# EAGLE design WalkSensor_V3.0 (EAGLE 9.6.0)
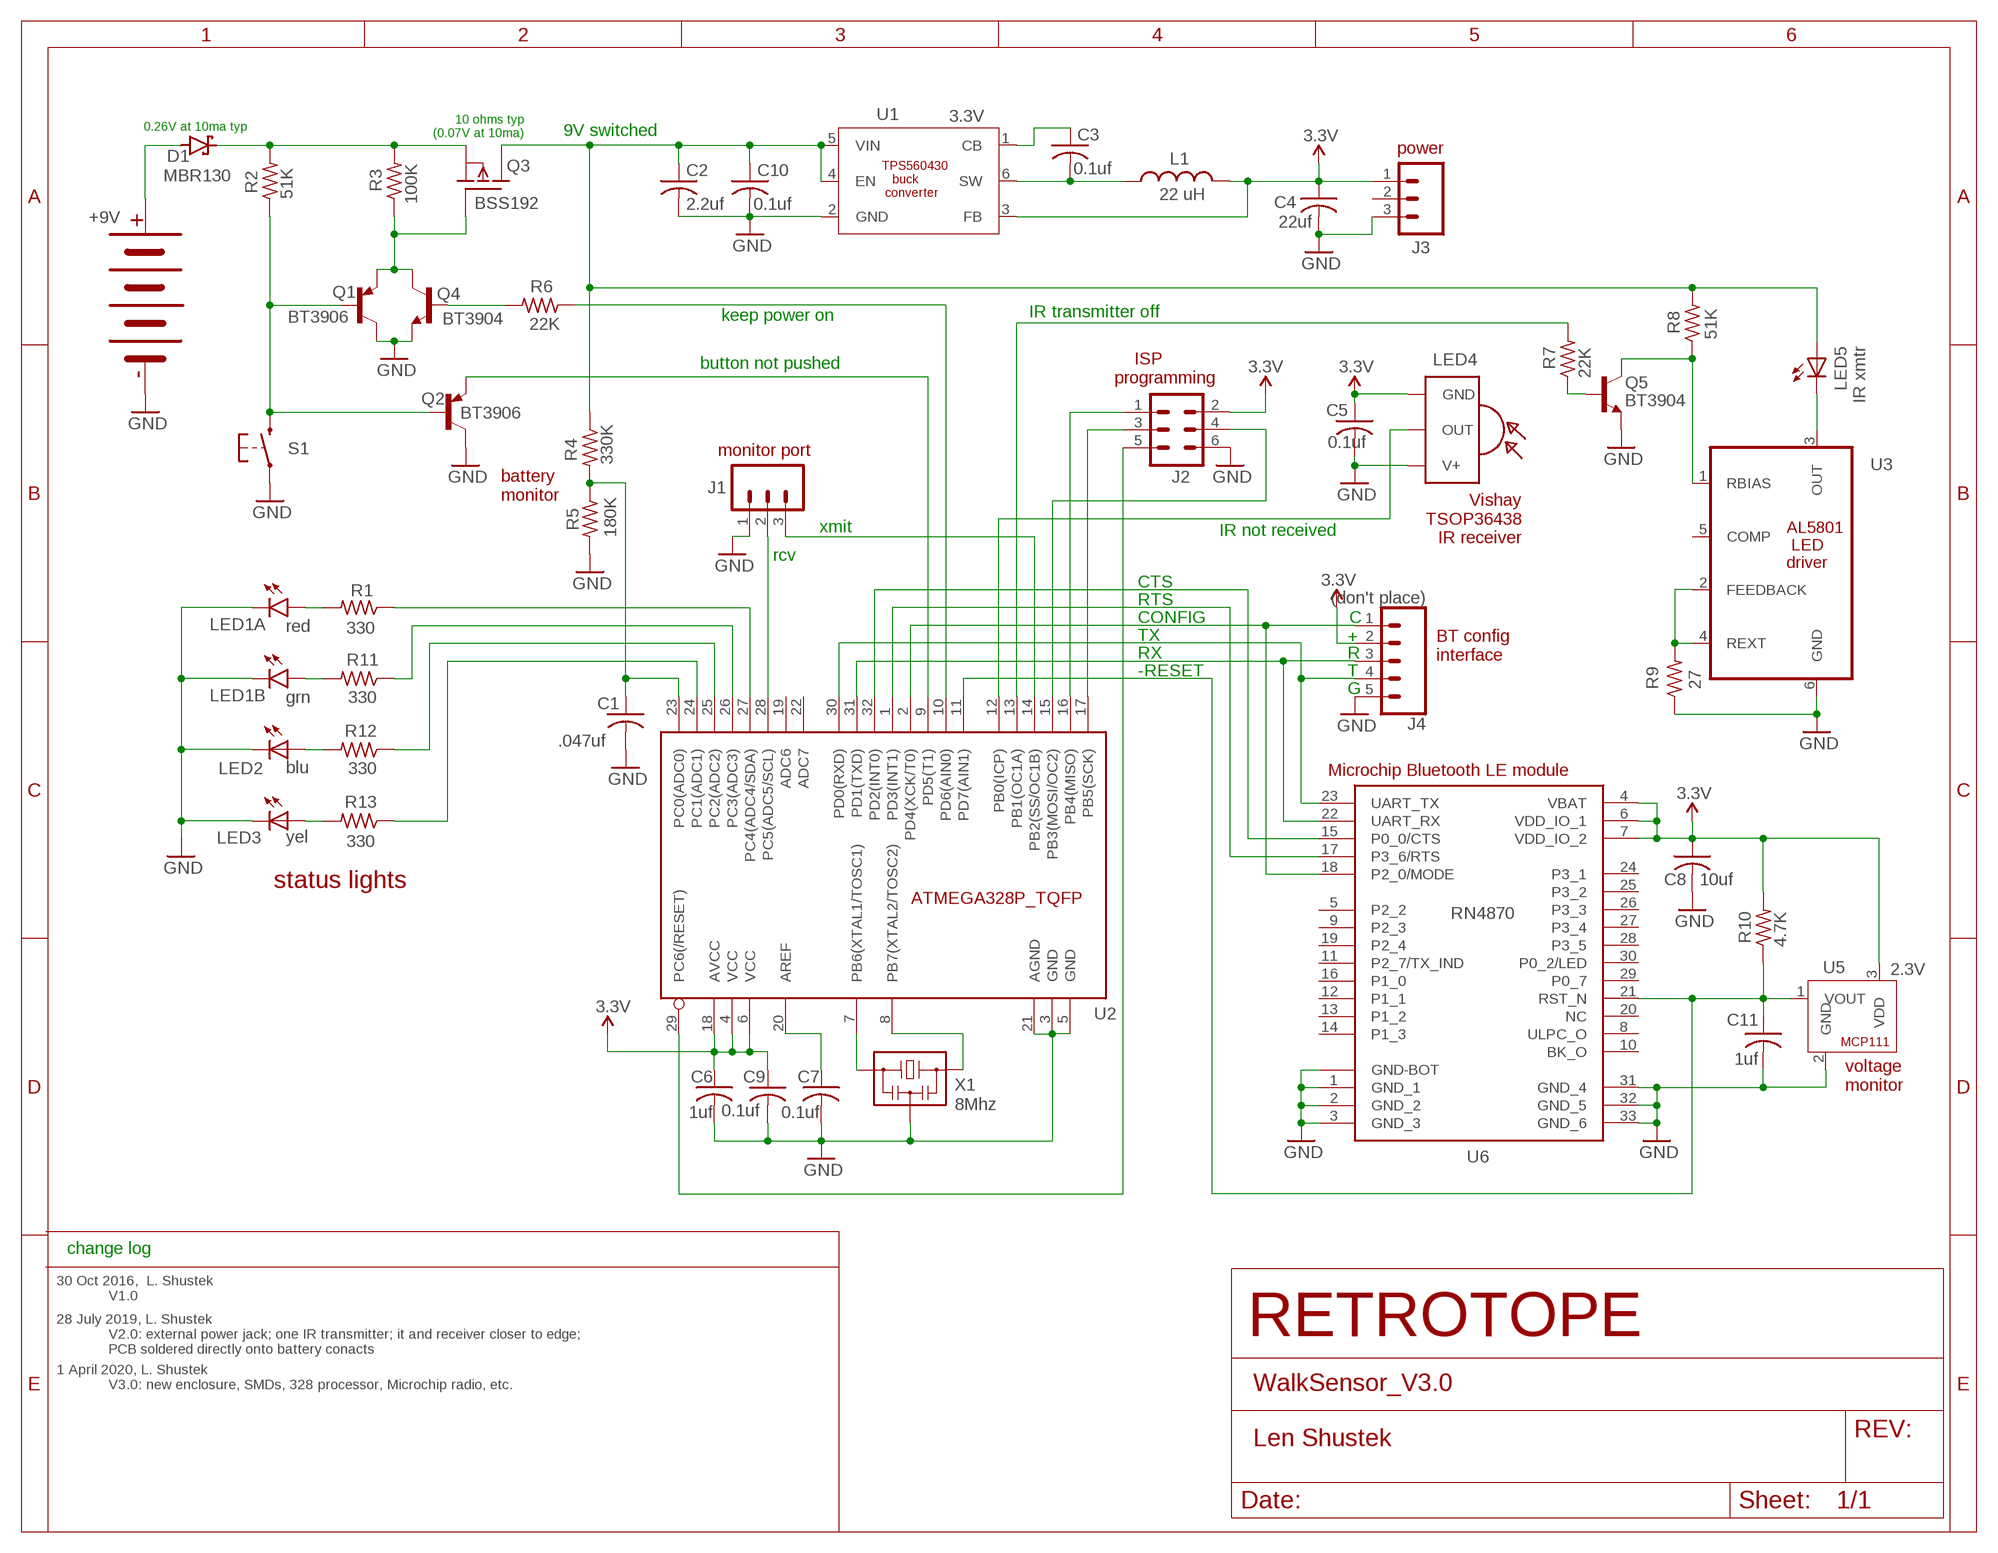
[diagram p0: schematic, sheet 1]

## Parts
B1  9V battery wires  4-CELL-BATTERY  [4-CELL-BATTERY]
C1  .047uf  C-USC0805  [C0805]
C2  2.2uf  C-USC1210  [C1210]
C3  0.1uf  C-USC0805  [C0805]
C4  22uf  C-USC1210  [C1210]
C5  0.1uf  C-USC0805  [C0805]
C6  1uf  C-USC0805  [C0805]
C7  0.1uf  C-USC0805  [C0805]
C8  10uf  C-USC1210  [C1210]
C9  0.1uf  C-USC0805  [C0805]
C10  0.1uf  C-USC0805  [C0805]
C11  1uf  C-USC0805  [C0805]
D1  MBR130  DIODE,SCHOTTKY  [SOD123-2]
J1  (don't place)  CONN_03  [1X03]
J2  ISP pgm connector  CONN_03X22X3_SMT  [2X3_SMT]
J3  (don't place)  CONN_03  [1X03]
J4  (don't place)  CONN_05  [1X05]
L1  22 uH  L-USL1812  [L1812]
LED1  red/grn  LED_DUALP-LCC4-1  [P-LCC4-1]
LED2  blu  LEDPLCC-2  [LED_PLCC-2]
LED3  yel  LEDPLCC-2  [LED_PLCC-2]
LED4  IR rcvr  IR_RCVRVISHAY_TSOP_SMD_SIDE  [VISHAY_TSOP_SMD_SIDE]
LED5  IR xmtr  LEDLED_VISHAY_VSMB2948  [LED_VISHAY_VSMB2948]
Q1  BT3906  PNP_TRANSISTORSOT23-3  [SOT23-3]
Q2  BT3906  PNP_TRANSISTORSOT23-3  [SOT23-3]
Q3  BSS192  VP3203SOP89  [SOT89]
Q4  BT3904  NPN-TRANSISTORSOT23-3  [SOT23-3]
Q5  BT3904  NPN-TRANSISTORSOT23-3  [SOT23-3]
R1  330  R-US_M0805  [M0805]
R2  51K  R-US_M0805  [M0805]
R3  100K  R-US_M0805  [M0805]
R4  330K  R-US_M0805  [M0805]
R5  180K  R-US_M0805  [M0805]
R6  22K  R-US_M0805  [M0805]
R7  22K  R-US_M0805  [M0805]
R8  51K  R-US_M0805  [M0805]
R9  27  R-US_M0805  [M0805]
R10  4.7K  R-US_M0805  [M0805]
R11  330  R-US_M0805  [M0805]
R12  330  R-US_M0805  [M0805]
R13  330  R-US_M0805  [M0805]
S1  pushbutton  PUSHBUTTON-SPSTC&K_GULLWING  [SWITCH_C&K_GULLWING]
U1  3.3V  TPS560430  [SOT23-6]
U2  ATMEGA328P_TQFP  [TQFP32-08]
U3  AL5801  [SOT95P280X130-6N]
U5  2.3V  MCP111SC-70  [SC70-3-R]
U6  RN4870  RN4870-V_RM118LJS1  [RN4870]
X1  8Mhz  CSTCRCSTNE  [CSTNE]

## Nets
3.3V [power]: C4.1 C5.1 C6.1 C8.1 C9.1 J2.2 J3.1 J4.2 L1.2 LED4.P$1(GND) R10.2 U1.3(FB) U2.4(VCC) U2.6(VCC) U2.18(AVCC) U5.3(VDD) U6.4(VBAT) U6.6(VDD_IO_1) U6.7(VDD_IO_2)
GND [ground]: B1.P$1 C1.2 C2.2 C4.2 C5.2 C6.2 C7.2 C8.2 C9.2 C10.2 C11.2 J1.1 J2.6 J3.3 J4.5 LED1.P$1(A:C) LED1.P$4(B:C) LED2.P$2(C) LED3.P$2(C) LED4.P$3(V+) Q1.3(C) Q2.3(C) Q4.2(E) Q5.2(E) R5.2 R9.1 S1.P$1 S1.P$2 U1.2(GND) U2.3(GND) U2.5(GND) U2.21(AGND) U3.6(GND) U5.2(GND) U6.1(GND_1) U6.2(GND_2) U6.3(GND_3) U6.31(GND_4) U6.32(GND_5) U6.33(GND_6) U6.GND(GND-BOT) X1.P$2
N$1: C3.1 U1.1(CB)
N$2: LED1.P$2(A:A) R1.2
N$3: U2.8(PB7(XTAL2/TOSC2)) X1.P$3
N$4: LED1.P$3(B:A) R11.2
N$5: U2.7(PB6(XTAL1/TOSC1)) X1.P$1
N$6: Q5.1(B) R7.1
N$7 [power]: D1.P$2(C) Q3.3(S) R2.2 R3.2
N$8 [power]: C3.2 L1.1 U1.6(SW)
N$9: R1.1 U2.27(PC4(ADC4/SDA))
N$10: R11.1 U2.26(PC3(ADC3))
N$11 [low power]: LED5.P$1(C) U3.3(OUT)
N$12: R7.2 U2.13(PB1(OC1A))
N$13: LED2.P$1(A) R12.2
N$14: LED3.P$1(A) R13.2
N$15: J4.3 U2.31(PD1(TXD)) U6.22(UART_RX)
N$16: R12.1 U2.25(PC2(ADC2))
N$17: Q1.2(E) Q3.1(G) Q4.3(C) R3.1
N$18: Q4.1(B) R6.2
N$19: R9.2 U3.2(FEEDBACK) U3.4(REXT)
N$20: C1.1 R4.2 R5.1 U2.23(PC0(ADC0))
N$21: Q5.3(C) R8.1 U3.1(RBIAS)
N$22: R13.1 U2.24(PC1(ADC1))
N$23: Q2.2(E) U2.9(PD5(T1))
N$24: J2.1 U2.16(PB4(MISO))
N$25: LED4.P$4(OUT) U2.12(PB0(ICP))
N$26: J2.3 U2.17(PB5(SCK))
N$27: J4.4 U2.30(PD0(RXD)) U6.23(UART_TX)
N$28: J1.2 U2.28(PC5(ADC5/SCL))
N$29: R6.1 U2.10(PD6(AIN0))
N$30: J2.5 U2.29(PC6(/RESET))
N$32: J4.1 U2.2(PD4(XCK/T0)) U6.18(P2_0/MODE)
N$33: Q1.1(B) Q2.1(B) R2.1 S1.P$3 S1.P$4
N$35: J1.3 U2.14(PB2(SS/OC1B))
N$36: U2.32(PD2(INT0)) U6.15(P0_0/CTS)
N$37: C7.1 U2.20(AREF)
N$38: J2.4 U2.15(PB3(MOSI/OC2))
N$39: U2.1(PD3(INT1)) U6.17(P3_6/RTS)
N$40: C11.1 R10.1 U2.11(PD7(AIN1)) U5.1(VOUT) U6.21(RST_N)
N$41 [power]: C2.1 C10.1 LED5.P$2(A) Q3.2(D) Q3.2@1(D) R4.1 R8.2 U1.4(EN) U1.5(VIN)
N$58 [power]: B1.P$2 D1.P$1(A)
Unconnected: J3.2 U2.19(ADC6) U2.22(ADC7) U3.5(COMP) U6.5(P2_2) U6.8(ULPC_O) U6.9(P2_3) U6.10(BK_O) U6.11(P2_7/TX_IND) U6.12(P1_1) U6.13(P1_2) U6.14(P1_3) U6.16(P1_0) U6.19(P2_4) U6.20(NC) U6.24(P3_1) U6.25(P3_2) U6.26(P3_3) U6.27(P3_4) U6.28(P3_5) U6.29(P0_7) U6.30(P0_2/LED)

## Notes on the sheet
- 10 ohms typ
  (0.07V at 10ma)
- 0.26V at 10ma typ
- 9V switched
- power
- +9V
- keep power on | IR transmitter off
- button not pushed
- ISP
  programming
- monitor port
- battery
  monitor
- xmit | IR not received
- Vishay
  TSOP36438
  IR receiver
- rcv
- CTS
- RTS
- CONFIG | C
- red
- TX | +
- RX | R
- BT config
  interface
- -RESET | T
- G
- grn
- Microchip Bluetooth LE module
- status lights
- voltage
  monitor
- change log
- 30 Oct 2016,  L. Shustek
               V1.0
- RETROTOPE
- 28 July 2019, L. Shustek
               V2.0: external power jack; one IR transmitter; it and receiver closer to edge;
               PCB soldered directly onto battery conacts
- 1 April 2020, L. Shustek
               V3.0: new enclosure, SMDs, 328 processor, Microchip radio, etc.
- Len Shustek

## Library data of the parts
B1 = Len:4-CELL-BATTERY
C1-C11 = resistor:C-US: CAPACITOR, American symbol
D1 = Len:DIODE,SCHOTTKY: Schottky diode
J1 J3 = SparkFun-Connectors:CONN_03: Multi connection point. Often used as Generic Header-pin footprint for 0.1 inch spaced/style header connections On any of the 0.1 inch spaced packages, you can populate with these: Break Away Headers - Straight <https://www.sparkfun.com/products/116> (PRT-00116) Break Away Male Headers - Right Angle <https://www.sparkfun.com/products/553> (PRT-00553) Female Headers <https://www.sparkfun.com/products/115> (PRT-00115) Break Away Headers - Machine Pin <https://www.sparkfun.com/products/117> (PRT-00117) Break Away Female Headers - Swiss Machine Pin <https://www.sparkfun.com/products/743> (PRT-00743) Stackable Header - 3 Pin (Female, 0.1") <https://www.sparkfun.com/products/13875> (PRT-13875) For SCREWTERMINALS and SPRING TERMINALS visit here: Screw Terimnals on SparkFun.com <https://www.sparkfun.com/search/results?term=Screw+Terminals> (5mm/3.5mm/2.54mm spacing) This device is also useful as a general connection point to wire up your design to another part of your project. Our various solder wires solder well into these plated through hole pads. Hook-Up Wire - Assortment (Stranded, 22 AWG) <https://www.sparkfun.com/products/11375> (PRT-11375) Hook-Up Wire - Assortment (Solid Core, 22 AWG) <https://www.sparkfun.com/products/11367> (PRT-11367) View the entire wire category on our website here <https://www.sparkfun.com/categories/141> Special notes: Molex polarized connector foot print use with SKU : PRT-08232 with associated crimp pins and housings.; PROD_ID: XXX-00000; VALUE: 455-1750-1-ND
J2 = SparkFun-Connectors:CONN_03X2: Multi connection point. Often used as Generic Header-pin footprint for 0.1 inch spaced/style header connections You can populate with any combo of single row headers, but if you'd like an exact match, check these: Header - 2x3 (Male, 0.1") <https://www.sparkfun.com/products/12807> (PRT-12807) Header - 2x3 (Female, 0.1") <https://www.sparkfun.com/products/13010> (PRT-13010) 2x3 Pin Shrouded Header <https://www.sparkfun.com/products/10877> (PRT-10877) On any of the 0.1 inch spaced packages, you can populate with these: Break Away Headers - Straight <https://www.sparkfun.com/products/116> (PRT-00116) Break Away Male Headers - Right Angle <https://www.sparkfun.com/products/553> (PRT-00553) Female Headers <https://www.sparkfun.com/products/115> (PRT-00115) Break Away Headers - Machine Pin <https://www.sparkfun.com/products/117> (PRT-00117) Break Away Female Headers - Swiss Machine Pin <https://www.sparkfun.com/products/743> (PRT-00743) Special note: the shrouded connector mates well with our 3x2 ribbon cables: Ribbon Crimp Connector - 6-pin (2x3, Female) <https://www.sparkfun.com/products/10651> (PRT-10651) Ribbon Cable - 6 wire (15ft) <https://www.sparkfun.com/products/10646> (PRT-10646)
J4 = SparkFun-Connectors:CONN_05: Multi connection point. Often used as Generic Header-pin footprint for 0.1 inch spaced/style header connections On any of the 0.1 inch spaced packages, you can populate with these: Break Away Headers - Straight <https://www.sparkfun.com/products/116> (PRT-00116) Break Away Male Headers - Right Angle <https://www.sparkfun.com/products/553> (PRT-00553) Female Headers <https://www.sparkfun.com/products/115> (PRT-00115) Break Away Headers - Machine Pin <https://www.sparkfun.com/products/117> (PRT-00117) Break Away Female Headers - Swiss Machine Pin <https://www.sparkfun.com/products/743> (PRT-00743) For SCREWTERMINALS and SPRING TERMINALS visit here: Screw Terimnals on SparkFun.com <https://www.sparkfun.com/search/results?term=Screw+Terminals> (5mm/3.5mm/2.54mm spacing) This device is also useful as a general connection point to wire up your design to another part of your project. Our various solder wires solder well into these plated through hole pads. Hook-Up Wire - Assortment (Stranded, 22 AWG) <https://www.sparkfun.com/products/11375> (PRT-11375) Hook-Up Wire - Assortment (Solid Core, 22 AWG) <https://www.sparkfun.com/products/11367> (PRT-11367) View the entire wire category on our website here <https://www.sparkfun.com/categories/141> Special notes: Molex polarized connector foot print use with SKU : PRT-08231 with associated crimp pins and housings. 1MM SMD Version SKU: PRT-10208
L1 = resistor:L-US: INDUCTOR, American symbol
LED1 = Len:LED_DUAL: LSG T676 Hyper Multi TOPLED ® Hyper-Bright LED Avago PLCC-4 HSMx-A2 and HSMx-A3 Source: http://docs-europe.electrocomponents.com/webdocs/08c3/0900766b808c36ca.pdf
LED2 LED3 LED5 = Len:LED: LED OSRAM: - CHIPLED LG R971, LG N971, LY N971, LG Q971, LY Q971, LO R971, LY R971 LH N974, LH R974 LS Q976, LO Q976, LY Q976 LO Q996 - Hyper CHIPLED LW Q18S LB Q993, LB Q99A, LB R99A - SideLED LS A670, LO A670, LY A670, LG A670, LP A670 LB A673, LV A673, LT A673, LW A673 LH A674 LY A675 LS A676, LA A676, LO A676, LY A676, LW A676 LS A679, LY A679, LG A679 - Hyper Micro SIDELED® LS Y876, LA Y876, LO Y876, LY Y876 LT Y87S - SmartLED LW L88C, LW L88S LB L89C, LB L89S, LG L890 LS L89K, LO L89K, LY L89K LS L896, LA L896, LO L896, LY L896 - TOPLED LS T670, LO T670, LY T670, LG T670, LP T670 LSG T670, LSP T670, LSY T670, LOP T670, LYG T670 LG T671, LOG T671, LSG T671 LB T673, LV T673, LT T673, LW T673 LH T674 LS T676, LA T676, LO T676, LY T676, LB T676, LH T676, LSB T676, LW T676 LB T67C, LV T67C, LT T67C, LS T67K, LO T67K, LY T67K, LW E67C LS E67B, LA E67B, LO E67B, LY E67B, LB E67C, LV E67C, LT E67C LW T67C LS T679, LY T679, LG T679 LS T770, LO T770, LY T770, LG T770, LP T770 LB T773, LV T773, LT T773, LW T773 LH T774 LS E675, LA E675, LY E675, LS T675 LS T776, LA T776, LO T776, LY T776, LB T776 LHGB T686 LT T68C, LB T68C - Hyper Mini TOPLED® LB M676 - Mini TOPLED Santana® LG M470 LS M47K, LO M47K, LY M47K Source: http://www.osram.convergy.de/
LED4 = Len:IR_RCVR: Vishay IR receiver
Q1 Q2 = Len:PNP_TRANSISTOR: PNP transistor
Q3 = Len:VP3203: P-Channel Enhancement MOSFET (HEXFET); -100V; -12A; 0,3Ohm
Q4 Q5 = Len:NPN-TRANSISTOR
R1-R13 = resistor:R-US_: RESISTOR, American symbol
S1 = Len:PUSHBUTTON-SPST: Momentary Switch (Pushbutton) - SPST - Two Circuits Normally-open (NO) SPST momentary switches
U1 = Len:TPS560430: TPS560430 simple switcher buck voltage regulator
U2 = SparkFun-IC-Microcontroller:ATMEGA328P_TQFP: Popular 328P in QFP Storefront component: ATmega328 - TQFP <https://www.sparkfun.com/products/13448> (COM-13448) Datasheet <http://www.sparkfun.com/datasheets/Components/SMD/ATMega328.pdf> SparkFun Products SparkFun RedBoard - Programmed with Arduino <https://www.sparkfun.com/products/12757> (DEV-12757) Arduino Pro Mini 328 - 5V/16MHz <https://www.sparkfun.com/products/11113> (DEV-11113) Arduino Pro Mini 328 - 3.3V/8MHz <https://www.sparkfun.com/products/11114> (DEV-11114) SparkFun OpenLog <https://www.sparkfun.com/products/13712> (DEV-13712) SparkFun MicroView - OLED Arduino Module <https://www.sparkfun.com/products/12923> (DEV-12923) SparkFun Digital Sandbox <https://www.sparkfun.com/products/12651> (DEV-12651) SparkFun PicoBoard <https://www.sparkfun.com/products/11888> (WIG-11888) Arduino Fio <https://www.sparkfun.com/products/10116> (DEV-10116) LilyPad Arduino 328 Main Board <https://www.sparkfun.com/products/13342> (DEV-13342) SparkFun RedStick <https://www.sparkfun.com/products/13741> (DEV-13741) LilyPad MP3 <https://www.sparkfun.com/products/11013> (DEV-11013) LilyPad Arduino SimpleSnap <https://www.sparkfun.com/products/10941> (DEV-10941) SparkFun Stepoko <https://www.sparkfun.com/products/13899> (ROB-13899) SparkFun Geiger Counter <https://www.sparkfun.com/products/11345> (SEN-11345) SparkFun EL Sequencer <https://www.sparkfun.com/products/12781> (COM-12781) Arduino Pro 328 - 5V/16MHz <https://www.sparkfun.com/products/10915> (DEV-10915) CryptoCape <https://www.sparkfun.com/products/12773> (DEV-12773) SparkFun IR Thermometer Evaluation Board - MLX90614 <https://www.sparkfun.com/products/10740> (SEN-10740) SparkFun RedBot Mainboard <https://www.sparkfun.com/products/12097> (ROB-12097) Arduino Pro 328 - 3.3V/8MHz <https://www.sparkfun.com/products/10914> (DEV-10914) SparkFun Block for Intel® Edison - Arduino <https://www.sparkfun.com/products/13036> (DEV-13036) SparkFun Simon Says - Surface Mount Soldering Kit <https://www.sparkfun.com/products/10935> (KIT-10935) SparkFun 7-Segment Serial Display - Red <https://www.sparkfun.com/products/11441> (COM-11441) SparkFun 7-Segment Serial Display - White <https://www.sparkfun.com/products/11629> (COM-11629) SparkFun 7-Segment Serial Display - Yellow <https://www.sparkfun.com/products/11443> (COM-11443) SparkFun 7-Segment Serial Display - Kelly Green <https://www.sparkfun.com/products/11440> (COM-11440) SparkFun 7-Segment Serial Display - Blue <https://www.sparkfun.com/products/11442> (COM-11442) SparkFun OpenSegment Serial Display - 20mm (Blue) <https://www.sparkfun.com/products/11647> (COM-11647) SparkFun OpenSegment Serial Display - 20mm (Green) <https://www.sparkfun.com/products/11646> (COM-11646) SparkFun OpenSegment Serial Display - 20mm (White) <https://www.sparkfun.com/products/11648> (COM-11648) SparkFun OpenSegment Serial Display - 20mm (Red) <https://www.sparkfun.com/products/11644> (COM-11644) SparkFun OpenSegment Serial Display - 20mm (Yellow) <https://www.sparkfun.com/products/11645> (COM-11645) SparkFun OpenSegment Shield <https://www.sparkfun.com/products/13190> (DEV-13190); PROD_ID: IC-09069
U3 = Len:AL5801: 25V 10A GATE DRIVER IN SOT26; MPN: ZXGD3005E6TA; OC_FARNELL: 1904033; OC_NEWARK: 55T4050; PACKAGE: SOT-26-6; SUPPLIER: DIODES INC.
U5 = Len:MCP111: Microchip MCP111/112 Micropower voltage detector
U6 = RN4870-ljs:RN4870-V_RM118: Microchip RN4870-V/RM118 Bluetooth Chip 4.2 Source: Datasheet <http://docs-emea.rs-online.com/webdocs/152f/0900766b8152ff8f.pdf>
X1 = murata-filter:CSTCR: Resonator Source: murata.co.jp

## Net classes
1 power: width 0.508 mm
2 ground: width 0.508 mm
3 low power: width 0.381 mm

## Board
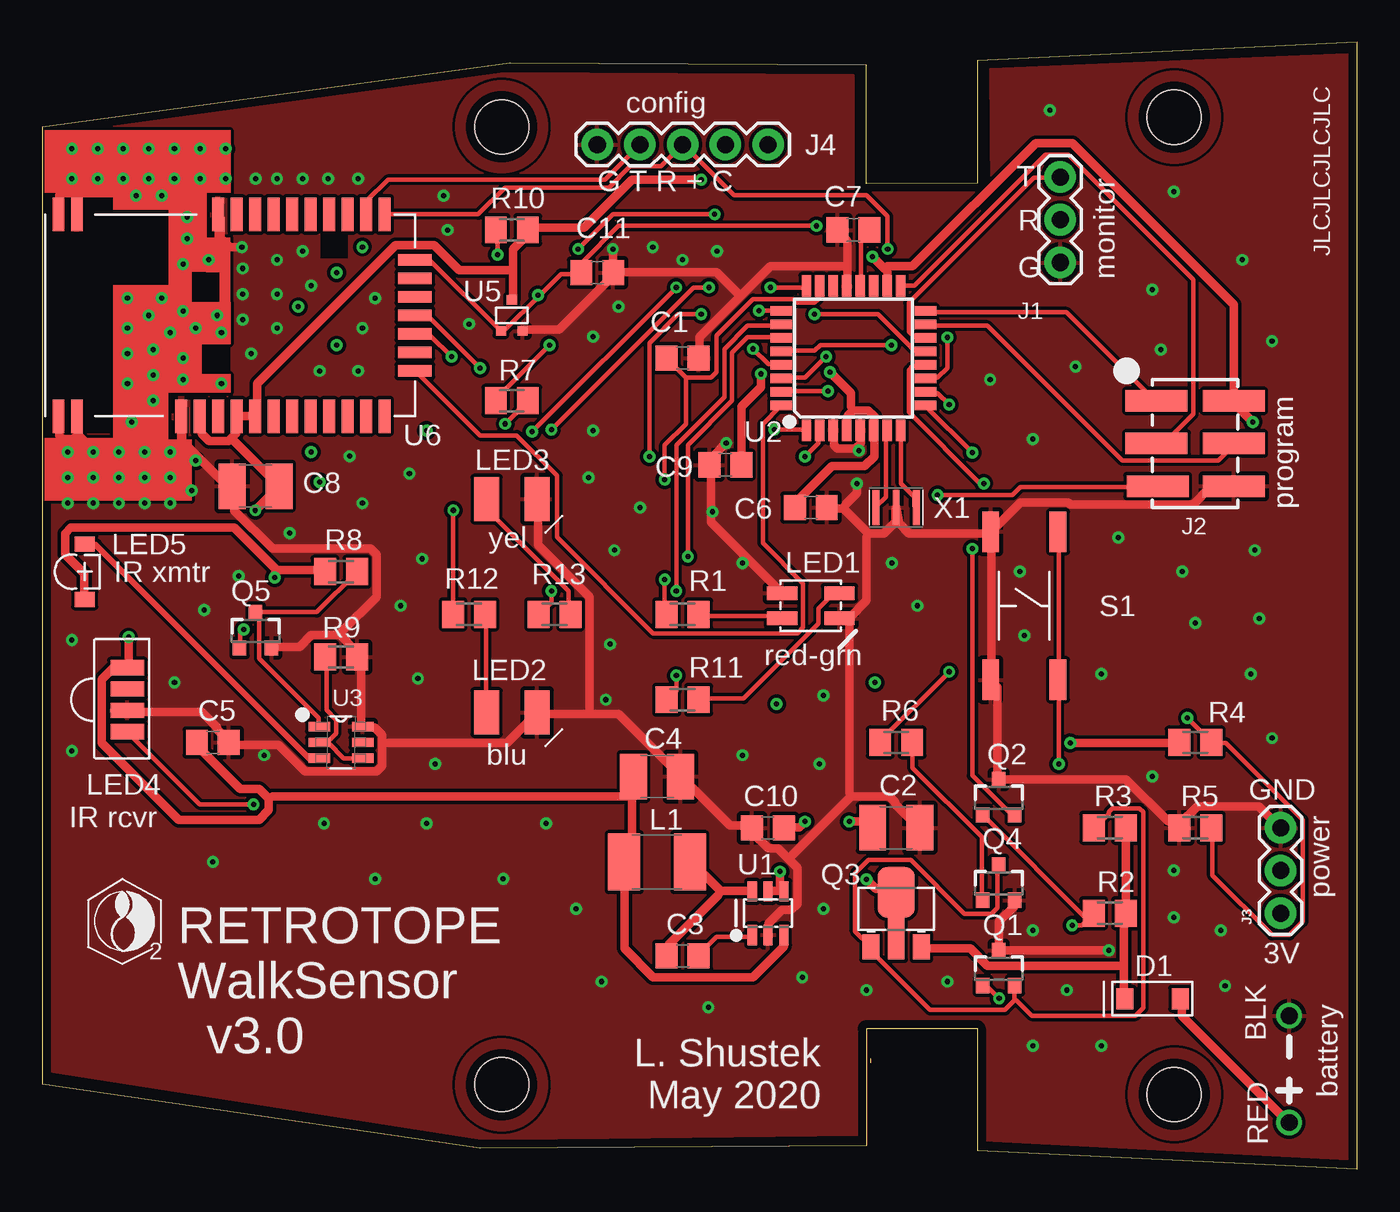
[diagram p1: board, top side]
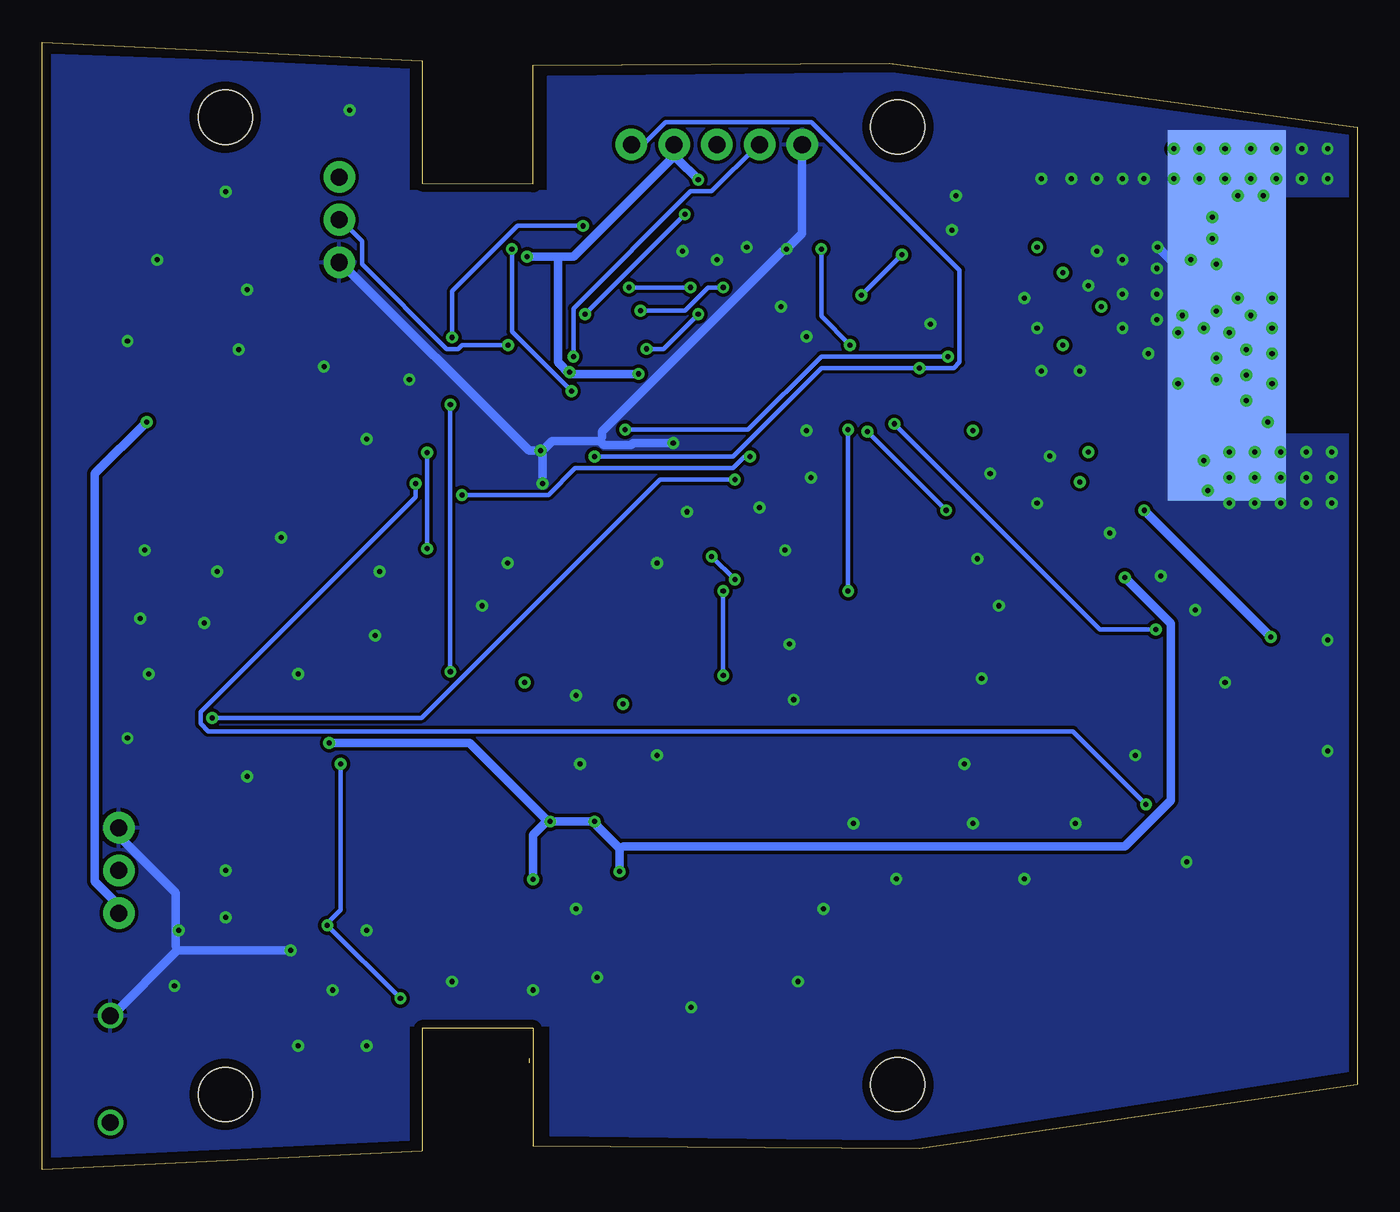
[diagram p2: board, bottom side, seen from below]

Size 78.23 x 67.06 mm. Coordinates in mm from the lower left corner, seen from the top.
Outline: 49.28,6.6 49.28,6.35
Outline: 78.23,0 78.23,67.06 55.63,65.94 55.63,58.67 49.02,58.62 49.02,65.68 27.84,65.79 0,61.98 0,5.08 26.06,1.27 49.02,1.42 49.02,8.38 55.63,8.38 55.63,1.12 78.23,0
Copper layers (1*16): Top 0.035mm / dielectric 1.5mm / Bottom 0.035mm
Design rules "default *": minimum track width 10mil, minimum drill 0.3mm, track to track 8mil, track to pad 8mil, pad to pad 8mil, via to via 8mil, smd to smd 8mil, copper to edge 20mil, drill to drill 8mil, minimum pad ring 10mil, minimum via ring 8mil, stop-mask expansion 4mil, vias tented up to drill 0mil, thermal gap 10mil
Holes 3.2 mm at 27.33,5.04 27.33,62.01 67.34,62.59 67.34,4.47
tRestrict: area 24.5,2.2 to 30.2,7.9; area 24.5,59.2 to 30.2,64.9; area 64.5,59.7 to 70.2,65.4; area 64.5,1.6 to 70.2,7.3

### Footprints (pad centres in the part's own frame; a part is rotated, then mirrored left to right if it is on the bottom)
4-CELL-BATTERY = drill 1: P$1 -3.81,0; P$2 2.54,0
C0805 = smd 1.3 x 1.5: 1 -0.95,0; 2 0.95,0
C1210 = smd 1.6 x 2.7: 1 -1.4,0; 2 1.4,0
SOD123-2 = smd 1 x 1.25: P$1 -1.65,0; P$2 1.65,0
1X03 = drill 1.016 pad 1.88: 1 0,0; 2 2.54,0; 3 5.08,0
2X3_SMT = smd 1.27 x 3.68: 1 -2.54,-2.3; 2 -2.54,2.3; 3 0,-2.3; 4 0,2.3; 5 2.54,-2.23; 6 2.54,2.3
1X05 = drill 1.016 pad 1.88: 1 0,0; 2 2.54,0; 3 5.08,0; 4 7.62,0; 5 10.16,0
L1812 = smd 1.9 x 3.4: 1 -1.95,0; 2 1.95,0
P-LCC4-1 = smd 1.8 x 0.8: P$1 -1.7,0.75; P$2 1.7,0.75; P$3 -1.7,-0.75; P$4 1.7,-0.75
LED_PLCC-2 = smd 1.5 x 2.6: P$1 -1.5,0; P$2 1.5,0
VISHAY_TSOP_SMD_SIDE = smd 0.9 x 2: P$1 -1.905,0; P$2 -0.635,0; P$3 0.635,0; P$4 1.905,0
LED_VISHAY_VSMB2948 = smd 0.9 x 1.2: P$1 -1.65,0; P$2 1.65,0
SOT23-3 = smd 0.8 x 0.9: 1 -0.95,-1; 2 0.95,-1; 3 0,1.1
SOT89 = smd 1 x 1.5: 1 -1.5,-2; 3 1.5,-2 | smd 1 x 5.5: 2 0,0 | smd 2.2 x 3: 2@1 0,1.25
M0805 = smd 1.3 x 1.6: 1 -0.95,0; 2 0.95,0
SWITCH_C&K_GULLWING = smd 2.4 x 1: P$1 -4.4,2; P$2 4.4,2; P$3 4.4,-2; P$4 -4.4,-2
SOT23-6 = smd 0.55 x 1.2: 1 -0.95,-1.3; 2 0,-1.3; 3 0.95,-1.3; 4 0.95,1.3; 5 0,1.3; 6 -0.95,1.3
TQFP32-08 = smd 1.27 x 0.559: 1 -4.293,2.8; 2 -4.293,2; 3 -4.293,1.2; 4 -4.293,0.4; 5 -4.293,-0.4; 6 -4.293,-1.2; 7 -4.293,-2; 8 -4.293,-2.8; 17 4.293,-2.8; 18 4.293,-2; 19 4.293,-1.2; 20 4.293,-0.4; 21 4.293,0.4; 22 4.293,1.2; 23 4.293,2; 24 4.293,2.8 | smd 0.559 x 1.27: 9 -2.8,-4.293; 10 -2,-4.293; 11 -1.2,-4.293; 12 -0.4,-4.293; 13 0.4,-4.293; 14 1.2,-4.293; 15 2,-4.293; 16 2.8,-4.293; 25 2.8,4.293; 26 2,4.293; 27 1.2,4.293; 28 0.4,4.293; 29 -0.4,4.293; 30 -1.2,4.293; 31 -2,4.293; 32 -2.8,4.293
SOT95P280X130-6N = smd 1.27 x 0.559: 1 -1.295,0.94; 2 -1.295,0; 3 -1.295,-0.94; 4 1.295,-0.94; 5 1.295,0; 6 1.295,0.94
SC70-3-R = smd 0.6 x 0.55: 1 -0.65,-0.925; 2 0.65,-0.925; 3 0,0.925
RN4870 = smd 2 x 0.7: 1 -6,10.2; 2 -6,9.1; 3 -6,2.9; 4 -6,1.8; 5 -6,0.7; 6 -6,-0.4; 7 -6,-1.5; 8 -6,-2.6; 9 -6,-3.7; 10 -6,-4.8; 11 -6,-5.9; 12 -6,-7; 13 -6,-8.1; 14 -6,-9.2; 22 6,-9.2; 23 6,-8.1; 24 6,-7; 25 6,-5.9; 26 6,-4.8; 27 6,-3.7; 28 6,-2.6; 29 6,-1.5; 30 6,-0.4; 31 6,0.7; 32 6,9.1; 33 6,10.2 | smd 0.7 x 2: 15 -3.3,-11; 16 -2.2,-11; 17 -1.1,-11; 18 0,-11; 19 1.1,-11; 20 2.2,-11; 21 3.3,-11 | smd 22 x 7 bottom: GND 0,3.4
CSTNE = smd 0.4 x 2.1: P$1 -1.2,0; P$2 0,0; P$3 1.2,0

### Placement (x,y rotation side)
B1  74.17,5.33 270 top
C1  38.1,48.26 0 top
C2  50.8,20.32 0 top
C3  38.1,12.7 180 top
C4  36.58,23.37 0 top
C5  10.16,25.4 0 top
C6  45.72,39.37 0 top
C7  48.26,55.88 180 top
C8  12.7,40.64 180 top
C9  40.64,41.91 180 top
C10  43.18,20.32 180 top
C11  33.02,53.34 0 top
D1  66.04,10.16 180 top
J1  60.55,53.95 90 top
J2  68.58,43.18 270 top
J3  73.66,15.24 90 top
J4  43.18,60.96 180 top
L1  36.58,18.29 180 top
LED1  45.72,33.53 180 top
LED2  27.94,27.18 0 top
LED3  27.94,39.88 0 top
LED4  5.08,27.94 270 top
LED5  2.54,35.56 270 top
Q1  56.9,11.94 0 top
Q2  56.9,22.1 0 top
Q3  50.8,15.24 0 top
Q4  56.9,17.02 0 top
Q5  12.7,32.02 0 top
R1  38.1,33.02 0 top
R2  63.5,15.24 0 top
R3  63.5,20.32 0 top
R4  68.58,25.4 0 top
R5  68.58,20.32 180 top
R6  50.8,25.4 0 top
R7  27.94,45.72 180 top
R8  17.78,35.56 180 top
R9  17.78,30.48 180 top
R10  27.94,55.88 0 top
R11  38.1,27.94 0 top
R12  25.4,33.02 0 top
R13  30.48,33.02 0 top
S1  58.42,33.53 90 top
U1  43.18,15.24 0 top
U2  48.26,48.26 90 top
U3  17.78,25.4 0 top
U5  27.94,50.8 0 top
U6  11.18,50.8 90 top
X1  50.8,39.37 0 top

### Tracks (layer width: path | path; a pad name or v marks a point on that pad's centre or on a via)
3.3V  (via drill 0.3)
  Top 0.508: 13.49,22.06 12.92,22.63 11.77,22.63 9.26,25.15 9.26,25.38 C5.1 | 13.49,22.06 13.49,21.37 12.92,20.8 8.12,20.8 3.54,25.38 3.54,29.15 4.23,29.83 5.03,29.83 LED4.P$1 5.14,30.06 v5.14,31.66 | U1.3 44.12,13.83 44.12,13.26 42.29,11.43 36.35,11.43 34.63,13.14 L1.2 34.75,18.52 35.09,18.86 35.09,23.32 C4.1 34.86,22.17 13.72,22.17 13.49,22.06 | 28,53.49 28,54.75 28.8,55.55 28.8,55.78 R10.2 29.03,56.01 32.23,56.01 35.09,58.86 v39.2,58.86 | 28,53.49 28,51.78 U5.3 | 11.26,43.49 11.54,43.78 11.54,44.69 U6.6 11.77,44.81 12.57,44.81 U6.7 12.8,45.03 12.8,46.75 21.03,54.98 23.32,54.98 24.8,53.49 28,53.49 | 11.26,43.49 11.09,43.32 9.94,43.32 9.49,43.78 9.49,44.69 U6.4 | 11.26,43.49 14.06,40.69 C8.1 13.95,40.46 v12.69,39.2 | 48.23,45.15 47.89,44.81 47.89,44.01 U2.4 | 48.23,45.15 49.15,45.15 49.49,44.81 49.49,44.01 U2.6 49.49,43.78 49.49,42.41 48.92,41.83 46.98,41.83 44.81,39.66 44.81,39.43 C6.1 | v49.38,54.29 50.12,53.55 | 50.12,53.55 50.29,53.38 50.29,52.58 U2.18 | v42.75,47.32 42.75,46.52 41.6,45.38 41.6,41.95 C9.1 | 50.12,53.55 50.29,53.72 51.78,53.72 59.09,61.04 61.27,61.04 70.87,51.44 70.87,45.72 J2.2 70.98,45.49 v72.01,44.46 | v46.86,47.43 48.12,46.18 48.12,45.38 48.23,45.15
  Bottom 0.508: 47.55,54.29 46.63,54.29 40.69,60.24 40.69,60.92 J4.2 40.46,60.12 v39.2,58.86 | 47.55,54.29 v49.38,54.29 | 46.86,47.32 v42.75,47.32 | 46.86,47.32 47.55,48.01 47.55,54.29 | v72.01,44.46 75.09,41.38 75.09,17.14 73.72,15.77 73.72,15.32 J3.1 | v46.86,47.43 46.86,47.32 | v12.69,39.2 v5.14,31.66
GND  (via drill 0.3)
  Top 0.508: 47.89,53.72 47.89,55.21 47.32,55.78 C7.2 | 47.89,53.72 47.89,52.58 U2.21 | 41.55,51.95 43.32,53.72 47.89,53.72 | 41.55,51.95 39.09,49.49 39.09,48.35 C1.2 | U5.2 28.69,49.95 30.75,49.95 34.06,53.26 C11.2 | v33.95,54.75 33.95,53.49 C11.2 | 41.55,51.95 40.12,53.38 34.29,53.38 C11.2 | LED1.P$4 44.01,34.29 39.78,38.52 39.78,41.83 C9.2 39.89,42.06 39.89,42.41 v40.69,43.2 | 48.35,42.86 47.32,42.86 47.09,43.09 47.09,43.89 U2.3 | 48.35,42.86 48.69,43.2 48.69,43.89 U2.5 | v48.58,42.75 48.35,42.86 | J3.3 73.61,20.34 72.35,21.6 68.69,21.6 67.67,20.57 67.67,20.34 R5.2 67.44,20.69 66.98,20.69 64.47,23.2 57.15,23.2 Q2.3 56.81,23.2 56.81,28.69 56.46,29.03 S1.P$1 56.46,29.38 56.46,37.6 S1.P$2 | Q4.2 57.84,16 57.84,15.66 56.92,14.74 56.92,13.14 Q1.3 57.15,13.03 v63.44,13.03 | 47.66,39.32 46.75,39.32 C6.2 | 49.15,37.83 47.66,39.32 | 49.15,37.83 50.06,37.83 50.75,38.52 50.75,39.32 X1.P$2 50.98,38.41 51.55,37.83 56.35,37.83 S1.P$2 | 49.15,37.83 49.03,37.6 49.03,33.83 48.01,32.8 47.43,32.8 LED1.P$1 48.01,32.58 48.01,22.4 48.12,22.17 | J2.6 70.87,40.58 69.49,40.58 68.47,39.55 61.15,39.55 61.04,39.66 58.18,39.66 56.58,38.06 S1.P$2 | v48.46,40.8 48.46,40.23 47.78,39.55 47.66,39.32 | 2,57.89 2.06,57.84 2.06,56.81 U6.32 | 2,57.89 1.83,58.06 1.14,58.06 1.03,57.95 1.03,56.81 U6.33 | 9.72,55.09 9.49,55.32 9.49,55.55 6.97,58.06 2.17,58.06 2,57.89 | 9.72,55.09 10.4,55.09 10.63,55.32 | 10.63,55.32 10.63,56.58 10.52,56.69 U6.31 | 2.06,43.66 1.83,43.43 1.26,43.43 1.03,43.66 1.03,44.69 U6.1 | 2.06,43.66 2.06,44.69 U6.2 | 7.2,43.09 8.23,43.09 8.34,43.2 | 7.2,43.09 2.74,43.09 2.29,43.55 2.06,43.66
  Top 0.508: 8.34,43.2 8.34,44.69 U6.3 | 8.34,43.2 8.57,43.09 10.97,40.69 11.2,40.69 C8.2 11.43,40.46 11.43,39.2 13.72,36.92 19.55,36.92 19.89,36.58 19.89,34.06 17.83,32 17.72,31.77 | 7.2,43.09 7.2,46.29 7.89,46.98 7.89,52.81 9.6,54.52 9.6,54.86 9.72,55.09 | LED4.P$3 5.14,27.2 9.49,27.2 10.4,26.29 10.4,26.18 11.09,25.49 C5.2 11.32,25.26 14.06,25.26 15.66,23.66 19.89,23.66 20.23,24 20.23,25.38 | 17.72,31.77 16,31.77 15.32,31.09 13.72,31.09 Q5.2 | 17.72,31.77 18.63,30.86 18.63,30.52 R9.1 18.86,30.29 18.97,30.18 18.97,26.4 U3.6 19.32,26.29 19.77,26.29 20.23,25.83 20.23,25.38 | 44.41,18.46 43.78,19.09 43.2,19.09 42.29,20 42.29,20.23 C10.2 42.06,20.46 40.92,20.46 38.18,23.2 C4.2 37.95,23.43 34.29,27.09 32.58,27.09 | 44.41,18.46 44.92,17.95 44.92,15.77 44.58,15.43 44.01,15.43 43.2,14.63 43.2,13.95 U1.2 | 48.12,22.17 50.41,22.17 50.75,21.83 50.75,21.72 52.12,20.34 C2.2 | 44.41,18.46 48.12,22.17 | 32.58,27.09 29.49,27.09 LED2.P$2 29.26,26.98 27.66,25.38 20.23,25.38 | 32.58,27.09 32.58,34.06 29.49,37.15 29.49,39.78 LED3.P$2 | v11.89,54.86 11.2,54.86 10.86,55.21 10.63,55.32
  Bottom 0.508: J4.5 33.03,60.92 33.03,55.66 v33.95,54.75 34.18,54.63 44.92,43.89 44.92,43.55 45.03,43.32 | v48.58,42.75 49.26,42.75 60.47,53.95 J1.1 | v40.69,43.2 43.09,43.2 43.2,43.09 44.81,43.09 45.03,43.32 | 45.03,43.32 47.89,43.32 48.35,42.86 v48.58,42.75 | 70.18,13.03 v63.44,13.03 | 70.18,13.03 74.07,9.14 B1.P$1 | J3.3 73.61,20.23 73.61,19.77 70.29,16.46 70.29,13.26 70.18,13.03 | v48.46,40.8 48.46,42.52 v48.58,42.75 | v11.89,54.86 7.89,50.86 U6.GND
  other vias: 1.52,42.67 3.05,42.67 4.57,42.67 6.1,42.67 1.52,41.15 3.05,41.15 4.57,41.15 6.1,41.15 7.62,41.15 1.52,39.62 3.05,39.62 4.57,39.62 6.1,39.62 7.62,39.62 8.89,40.39 7.62,42.67 5.33,44.45 6.6,45.72 5.08,46.74 6.6,47.24 5.08,48.51 7.62,49.78 5.08,50.04 7.11,51.82 10.67,49.78 11.94,50.55 11.94,52.07 11.94,53.59 13.97,54.1 13.97,52.07 13.97,50.04 16,52.58 16.51,47.5 18.8,47.5 19.05,50.04 1.78,60.71 1.78,58.93 3.3,58.93 3.3,60.71 4.83,60.71 4.83,58.93 6.35,58.93 6.35,60.71 7.87,60.71 7.87,58.93 9.4,58.93 10.92,58.93 12.7,58.93 13.97,58.93 15.49,58.93 17.02,58.93 18.8,58.93 23.88,57.91 24.13,55.88 19.81,51.82 25.4,50.29 32.77,49.53 34.29,51.31 36.32,54.86 38.1,54.1 40.13,54.61 18.29,42.42 14.73,37.85 19.05,39.62 21.84,41.4 32.77,43.94 32.51,41.15 35.56,39.37 34.04,36.83 39.88,39.12 41.66,36.07 33.78,31.24 33.53,27.94 16.76,20.57 22.86,20.57 29.97,20.57 23.37,24.13 41.66,24.64 46.23,24.13 46.48,28.19 50.55,36.07 56.39,46.99 58.93,43.43 61.47,47.75 66.55,48.77 66.04,52.32 59.94,62.99 67.31,58.17 71.37,54.1 73.15,49.28 64.01,37.59 67.82,35.56 72.14,36.83 72.39,32.77 68.58,32.51 71.88,29.46 62.99,29.46 52.07,33.53 73.15,25.65 66.04,23.37 67.31,17.78 67.31,14.99 70.1,14.22 70.36,10.92 62.99,7.37 58.93,7.37 53.85,11.18 60.96,10.67 58.93,14.22 46.48,15.49 49.02,10.67 45.21,11.43 39.62,9.65 33.27,11.18 31.75,15.49 27.43,17.27 19.81,17.27 10.16,18.29 7.87,28.96 1.78,31.5 1.78,24.89 13.21,24.64 9.65,33.27 11.68,35.31 22.61,36.32 21.34,33.53 22.35,29.21 58.17,35.56 58.42,31.75 8.64,55.37 8.64,56.64 12.45,48.51 15.49,54.61
  pour Top: 0.25,61.72 27.34,65.24 48.25,65.11 48.25,58.17 56.46,58.17 56.41,65.47 77.65,66.35 77.72,0.58 55.98,1.7 55.98,8.48 48.56,8.48 48.56,2.04 26.29,1.78 0.25,5.82
  pour Bottom: 0.25,61.72 27.64,65.19 48.16,65 48.16,58.19 56.39,58.19 56.39,65.52 77.72,66.29 77.72,0.76 56.39,1.78 56.39,8.56 48.01,8.56 48.01,2.03 26.92,1.78 0.25,5.9
N$1
  Top 0.254: U1.1 42.18,13.83 40.12,13.83 39.09,12.8 C3.1
N$2
  Top 0.254: R1.2 39.09,32.92 43.89,32.92 44.01,32.8 LED1.P$2
N$3
  Top 0.254: U2.8 51.09,43.89 51.09,40.8 51.89,40.01 51.89,39.43 X1.P$3
N$4
  Top 0.254: R11.2 39.09,28 41.72,28 46.18,32.46 46.18,33.38 46.98,34.18 47.32,34.18 LED1.P$3
N$5
  Top 0.254: U2.7 50.18,43.89 50.18,40.01 49.61,39.43 X1.P$1
N$6  (via drill 0.3)
  Top 0.254: v12,32.12 11.77,31.89 11.77,31.09 Q5.1 | v27.55,44.35 28.92,45.72 R7.1
  Bottom 0.254: v12,32.12 15.32,32.12 v27.55,44.35
N$7
  Top 0.508: 64.35,12.12 64.35,15.2 R2.2 64.47,15.43 64.47,20.23 R3.2 | 64.35,12.12 64.35,10.17 D1.P$2 | 64.35,12.12 56.24,12.12 55.21,13.14 52.35,13.14 Q3.3
N$8
  Top 0.508: 40.35,16.57 42.18,16.57 U1.6 | 40.35,16.57 38.63,18.29 L1.1 | C3.2 37.26,12.8 37.26,13.37 40.23,16.34 40.35,16.57
N$9  (via drill 0.3)
  Top 0.254: v38.41,36.46 38.41,43.09 41.03,45.72 41.03,48.58 41.95,49.49 43.89,49.49 U2.27 | v37.03,35.09 37.03,33.15 37.15,33.03 R1.1
  Bottom 0.254: v37.03,35.09 v38.41,36.46
N$10  (via drill 0.3)
  Top 0.254: v37.72,34.4 37.72,43.09 40.58,45.95 40.58,48.81 41.95,50.18 43.89,50.18 U2.26 | v37.72,29.38 37.72,28.46 37.26,28 R11.1
  Bottom 0.254: v37.72,29.38 v37.72,34.4
N$11
  Top 0.381: U3.3 15.89,24.46 3.2,37.15 2.63,37.15 LED5.P$1
N$12  (via drill 0.3)
  Top 0.254: v45.95,50.86 49.72,50.86 51.89,48.69 52.46,48.69 U2.13 | v40.01,56.81 33.95,56.81 v31.89,54.75 | v30.18,49.03 27.09,45.95 27.09,45.72 R7.2
  Bottom 0.254: v40.01,56.81 v45.95,50.86 | v31.89,54.75 31.89,50.75 v30.18,49.03
N$13
  Top 0.254: R12.2 26.4,32.92 26.4,27.2 LED2.P$1
N$14
  Top 0.254: R13.2 31.32,33.03 31.32,34.4 26.52,39.2 26.52,39.78 LED3.P$1
N$15  (via drill 0.3)
  Top 0.254: v46.75,46.29 44.01,46.29 U2.31 | v50.29,54.75 50.29,56.69 49.03,57.95 41.15,57.95 38.18,60.92 J4.3 36.8,59.66 34.98,59.66 33.72,58.41 27.55,58.41 25.95,56.81 20.46,56.81 U6.22
  Bottom 0.254: v46.75,46.29 50.29,49.84 v50.29,54.75
N$16  (via drill 0.3)
  Top 0.254: v42.63,51.09 43.89,51.09 U2.25 | v29.15,43.89 v37.72,52.46 | v24.46,39.2 24.46,33.03 R12.1
  Bottom 0.254: v42.63,51.09 40.01,51.09 38.63,52.46 v37.72,52.46 | v24.46,39.2 v29.15,43.89
N$17
  Top 0.254: 57.84,10.06 57.84,10.86 Q1.2 | 57.84,10.06 57.26,9.49 52.81,9.49 49.38,12.92 49.38,13.14 Q3.1 49.26,13.26 48.35,14.17 48.35,17.6 49.15,18.4 51.66,18.4 54.86,15.2 56.46,15.2 56.81,15.54 56.81,18.06 Q4.3 | R3.1 62.64,20.34 63.44,21.14 63.44,21.26 63.66,21.49 65.27,21.49 65.49,21.26 65.49,9.6 65.04,9.14 58.86,9.14 57.95,10.06 57.84,10.06
N$18
  Top 0.254: Q4.1 55.89,16.12 55.89,19.77 51.78,23.89 51.78,25.38 R6.2
N$19
  Top 0.254: U3.4 17.95,24.46 17.03,25.38 16.57,25.38 U3.2 17.03,25.49 17.49,25.95 17.49,26.75 16.92,27.32 16.92,30.4 R9.2
N$20  (via drill 0.3)
  Top 0.254: 38.29,47.09 39.78,47.09 40.12,47.43 40.12,49.61 42.29,51.78 44.69,51.78 44.92,51.55 45.95,51.55 46.18,51.78 46.18,52.46 U2.23 | 38.29,47.09 37.15,48.23 C1.1 | R5.1 69.61,20.23 69.61,17.49 73.15,13.95 74.18,13.95 74.98,14.74 74.98,20.8 70.41,25.38 69.61,25.38 R4.2 69.49,25.49 v68.12,26.86 | 38.29,47.09 38.29,44.35 37.03,43.09 v37.03,41.03
  Bottom 0.254: v37.03,41.03 41.49,41.03 55.66,26.86 v68.12,26.86
N$21
  Top 0.254: R8.1 18.75,35.55 16.34,33.15 12.8,33.15 Q5.3 12.92,33.03 12.92,30.4 16.46,26.86 16.46,26.4 U3.1
N$22  (via drill 0.3)
  Top 0.254: v43.32,52.46 45.38,52.46 U2.24 | v39.66,52.46 38.75,52.46 v30.29,44.01 | v30.29,34.4 30.29,33.72 29.6,33.03 R13.1
  Bottom 0.254: v39.66,52.46 v43.32,52.46 | v30.29,34.4 v30.29,44.01
N$23  (via drill 0.3)
  Top 0.254: v55.32,36.92 55.32,23.43 57.61,21.14 57.84,21.14 Q2.2 | v55.32,42.63 52.58,45.38 U2.9
  Bottom 0.254: v55.32,42.63 v55.32,36.92
N$24
  Top 0.254: U2.16 52.58,50.98 60.92,50.98 66.18,45.72 J2.1
N$25  (via drill 0.3)
  Top 0.254: v56.01,40.8 55.78,40.8 51.55,45.03 51.55,47.55 51.78,47.78 52.46,47.78 U2.12 | v12.57,21.72 9.37,21.72 5.14,25.95 LED4.P$4
  Bottom 0.254: v56.01,40.8 56.01,40.01 68.81,27.2 68.81,26.52 68.35,26.06 16.92,26.06 v12.57,21.72
N$26
  Top 0.254: U2.17 51.09,52.58 51.89,52.58 59.66,60.35 61.04,60.35 68.47,52.92 68.47,44.92 66.75,43.2 66.29,43.2 J2.3
N$27  (via drill 0.3)
  Top 0.254: v46.63,48.35 45.38,47.09 44.01,47.09 U2.30 | U6.23 19.32,56.81 19.32,57.61 20.57,58.86 33.49,58.86 35.55,60.92 J4.4
  Bottom 0.254: v46.63,48.35 46.63,51.21 39.66,58.18 38.41,58.18 35.66,60.92 J4.4
N$28  (via drill 0.3)
  Top 0.254: v50.52,49.03 46.29,49.03 45.95,48.69 44.01,48.69 U2.28
  Bottom 0.254: v50.52,49.03 53.26,49.03 53.49,48.81 54.18,48.81 59.21,53.84 59.21,55.21 60.47,56.46 J1.2
N$29  (via drill 0.3)
  Top 0.254: v53.95,45.49 53.26,46.18 52.58,46.18 U2.10 | v53.95,29.6 49.84,25.49 R6.1
  Bottom 0.254: v53.95,29.6 v53.95,45.49
N$30  (via drill 0.3)
  Top 0.254: v42.29,48.81 43.2,47.89 43.89,47.89 U2.29 | v39.2,50.86 37.83,50.86 36.12,49.15 v36.12,42.41 | v53.26,40.12 57.72,40.12 58.18,40.58 66.29,40.58 J2.5
  Bottom 0.254: v42.29,48.81 41.26,48.81 v39.2,50.86 | v36.12,42.41 36.46,42.41 37.15,41.72 46.52,41.72 48.12,40.12 v53.26,40.12
N$31  (via drill 0.3)
  other vias: -20.32,43.18
N$32  (via drill 0.3)
  Top 0.254: v45.38,42.41 46.18,43.2 46.18,43.89 U2.2 | v26.06,47.66 22.97,50.75 22.29,50.75 U6.18
  Bottom 0.254: v45.38,42.41 37.15,42.41 31.89,47.66 v26.06,47.66 24,47.66 23.66,48.01 23.66,53.49 32.46,62.29 41.15,62.29 42.41,61.04 43.09,61.04 J4.1
N$33  (via drill 0.3)
  Top 0.254: S1.P$3 60.47,37.83 60.47,29.15 S1.P$4 60.47,29.03 v60.47,24.12 | v56.92,10.17 56.24,10.86 56.01,10.86 Q1.1 | v61.27,14.52 61.84,14.52 62.18,14.86 | 62.18,14.86 62.52,15.2 R2.1 62.18,14.86 | 62.18,14.86 56.01,21.03 Q2.1
  Bottom 0.254: v56.92,10.17 v61.27,14.52 61.27,14.63 60.47,15.43 v60.47,24.12
N$34  (via drill 0.3)
  other vias: 8.38,48.26
N$35
  Top 0.254: U2.14 52.46,49.49 51.89,49.49 51.55,49.84 51.55,51.55 58.98,58.98 60.47,58.98 J1.3
N$36
  Top 0.254: U2.32 43.89,45.38 42.86,44.35 42.86,37.26 45.26,34.86 45.26,32.23 44.92,31.89 36.35,31.89 30.63,37.6 30.63,41.26 28.23,43.66 26.06,43.66 22.29,47.43 U6.15
N$37
  Top 0.254: U2.20 48.69,52.58 48.69,55.32 49.15,55.78 C7.1
N$38
  Top 0.254: U2.15 52.58,50.18 56.24,50.18 64.24,42.18 69.95,42.18 70.87,43.09 J2.4
N$39  (via drill 0.3)
  Top 0.254: v43.55,44.01 45.38,44.01 U2.1 | v24.35,48.35 23.09,49.61 22.29,49.61 U6.17
  Bottom 0.254: v43.55,44.01 36.23,44.01 31.89,48.35 v24.35,48.35
N$40  (via drill 0.3)
  Top 0.254: 29.55,51.95 30.86,53.26 32,53.26 C11.1 32.12,53.38 32.12,53.95 34.29,56.12 v46.06,56.12 | 29.55,51.95 27.55,49.95 27.32,49.95 U5.1 27.2,49.95 23.09,54.06 22.29,54.06 U6.21 | v53.84,49.49 53.84,47.66 53.26,47.09 52.58,47.09 U2.11 | v27.09,54.41 27.09,55.78 R10.1 | v29.49,52.01 29.55,51.95
  Bottom 0.254: v53.84,49.49 53.84,52.23 49.95,56.12 v46.06,56.12 | v29.49,52.01 v27.09,54.41
N$41  (via drill 0.3)
  Top 0.508: 13.95,35.66 11.43,38.18 1.71,38.18 1.37,37.83 1.37,36.58 2.52,35.43 2.52,33.95 LED5.P$2 | 13.95,35.66 16.8,35.66 R8.2 | Q3.2 50.86,15.32 50.86,16.46 Q3.2@1 50.63,16.69 49.61,16.69 v49.03,17.26 | U1.5 43.2,16.57 44.12,16.57 U1.4 43.89,16.8 v43.89,17.72 | v45.38,20.69 45.03,20.34 44.23,20.34 C10.1 | v48.01,20.69 49.03,20.69 49.38,20.34 C2.1 | v61.15,25.38 67.55,25.38 R4.1 | v13.83,35.2 13.83,35.43 13.95,35.66
  Bottom 0.508: v48.01,20.69 v45.38,20.69 45.26,20.46 43.89,19.09 | 43.89,19.09 v43.89,17.72 | v61.15,25.38 52.81,25.38 48.23,20.8 v48.01,20.69 | v49.03,17.26 49.03,19.89 48.35,20.57 v48.01,20.69 | v13.83,35.2 11.09,32.46 11.09,21.95 13.83,19.2 43.66,19.2 43.89,19.09
N$42  (via drill 0.3)
  other vias: 17.53,49.02
N$43  (via drill 0.3)
  other vias: 5.59,57.91
N$44  (via drill 0.3)
  other vias: 7.11,57.91
N$45  (via drill 0.3)
  other vias: 5.08,51.82
N$46  (via drill 0.3)
  other vias: 6.35,50.8
N$47  (via drill 0.3)
  other vias: 6.6,48.77
N$48  (via drill 0.3)
  other vias: 8.38,46.99
N$49  (via drill 0.3)
  other vias: 8.38,51.05
N$50  (via drill 0.3)
  other vias: 8.38,53.85
N$51  (via drill 0.3)
  other vias: 9.91,54.1
N$52  (via drill 0.3)
  other vias: 9.14,50.04
N$53  (via drill 0.3)
  other vias: 10.41,50.8
N$54  (via drill 0.3)
  other vias: 10.67,46.74
N$55  (via drill 0.3)
  other vias: 15.24,51.31
N$56  (via drill 0.3)
  other vias: 17.53,53.34
N$57  (via drill 0.3)
  other vias: 19.05,54.86
N$58
  Top 0.508: D1.P$1 67.78,10.06 67.78,9.14 74.07,2.86 B1.P$2
N$59  (via drill 0.3)
  other vias: 16.51,40.89
N$60  (via drill 0.3)
  other vias: 22.86,43.94
N$61  (via drill 0.3)
  other vias: 9.4,60.71
N$62  (via drill 0.3)
  other vias: 10.92,60.71
N$63  (via drill 0.3)
  other vias: 9.14,42.16
N$64  (via drill 0.3)
  other vias: 16,42.67
N$65  (via drill 0.3)
  other vias: 49.53,28.96
N$66  (via drill 0.3)
  other vias: 43.69,27.69

### Text on the board
tPlace: JLCJLCJLCJLC | config | G T R + C | T | R | G | monitor | program | red-grn | GND | power | 3V | 2 | battery | L. Shustek / May 2020 | BLK | RETROTOPE / WalkSensor / v3.0 | RED
tNames: IR xmtr | IR rcvr